# EasyEDA schematic schemes.json

## Sheets
1 Sheet_1: TITLE: Sheet_1; REV: 1.0; Date: 2024-04-25; Sheet: 1/1; Company: Your Company
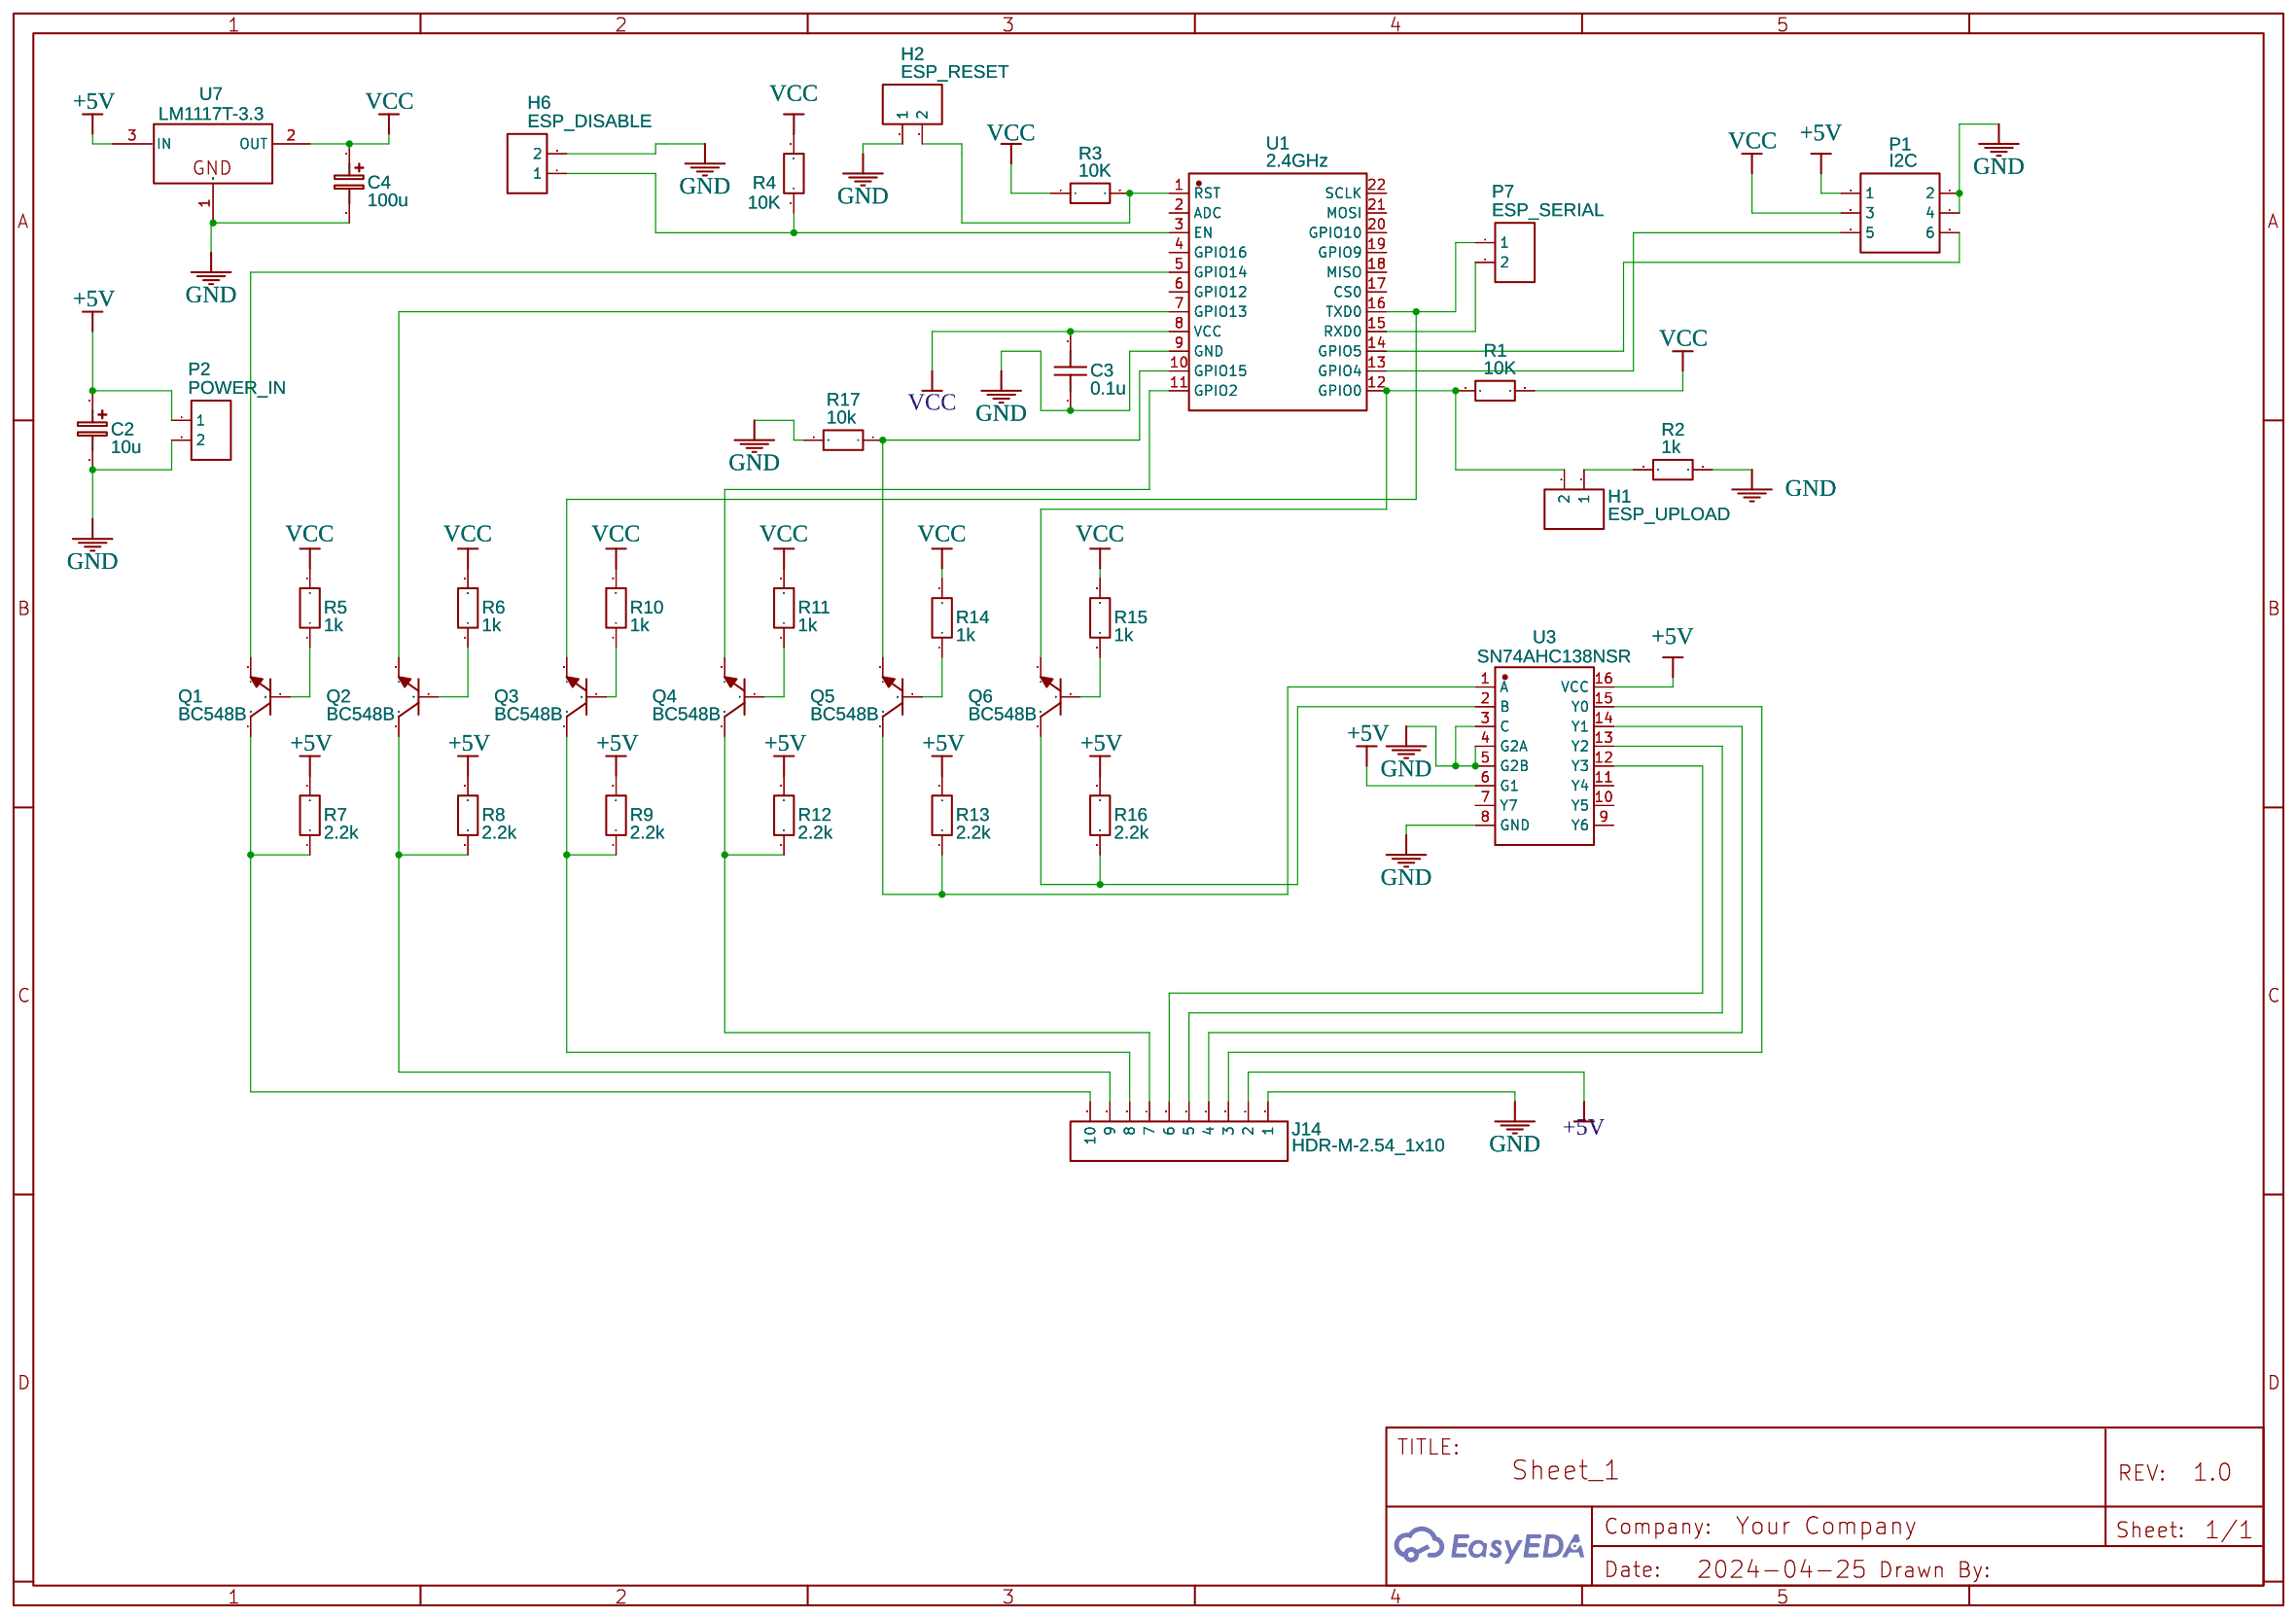
[diagram p0: Sheet_1]
2 Sheet_2: TITLE: Sheet_2; Date: 2024-07-30; Drawn By: juliaotran
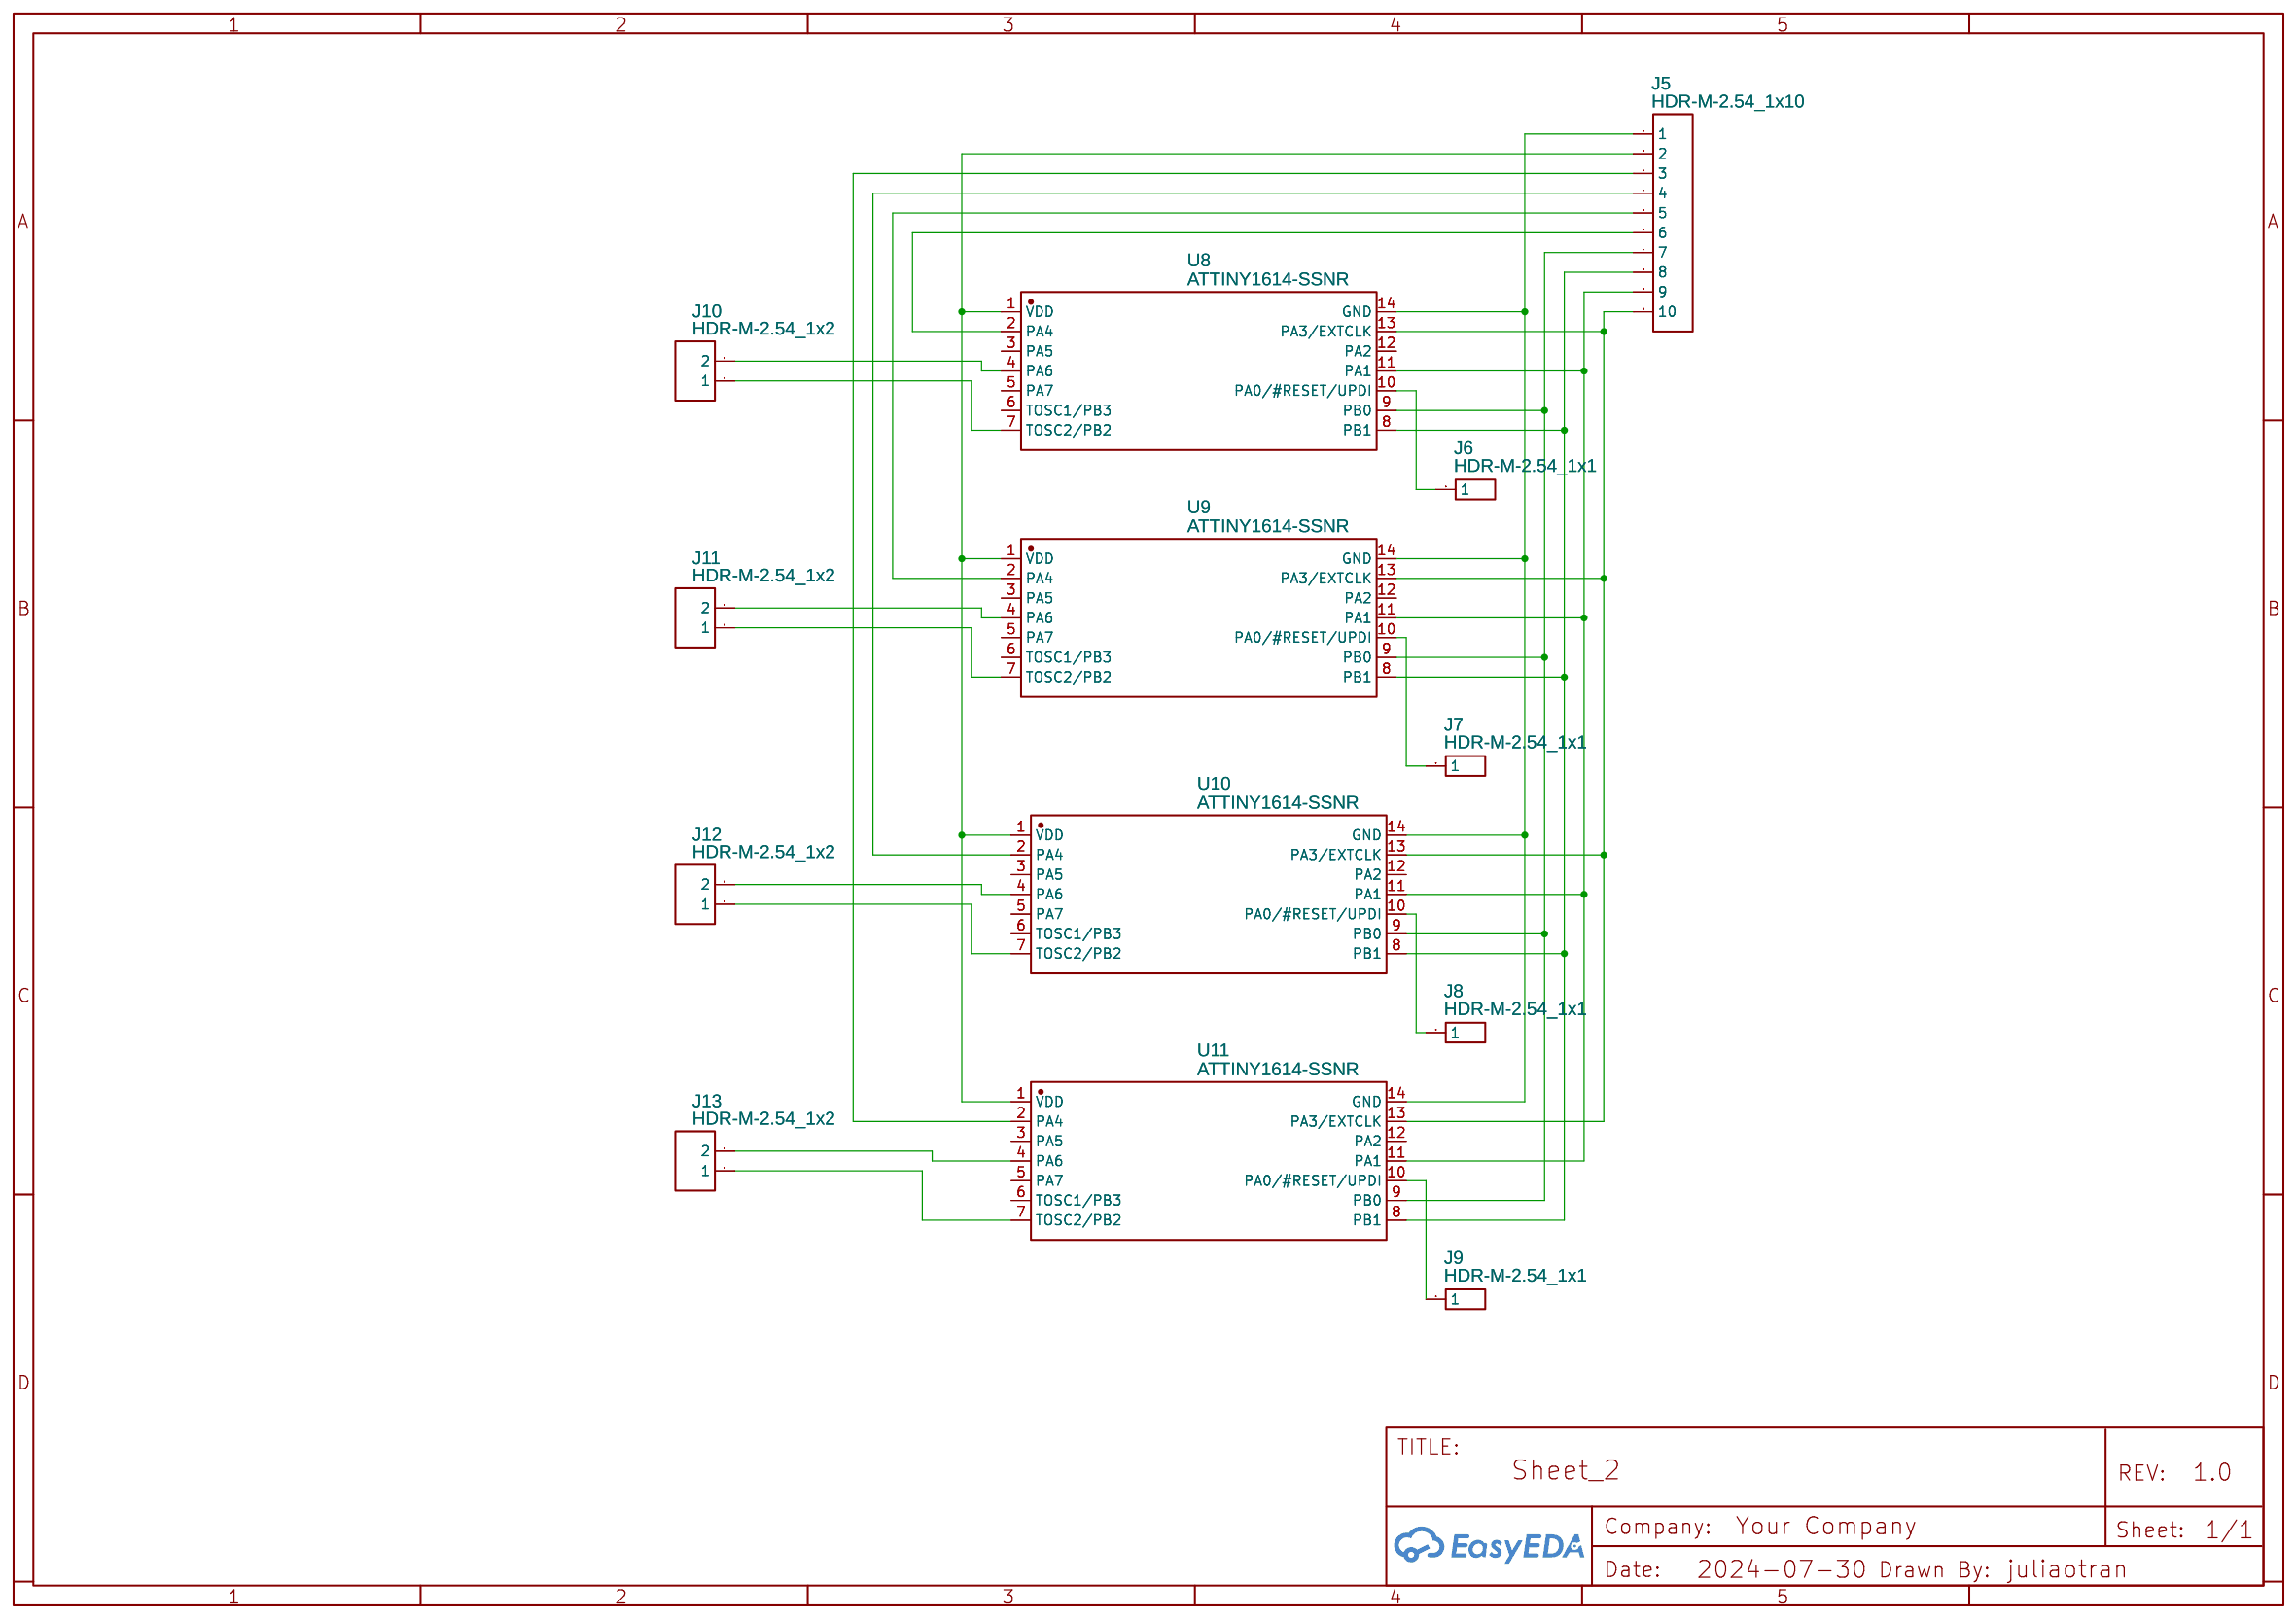
[diagram p1: Sheet_2]
3 Sheet_3: TITLE: Sheet_3; Date: 2024-09-19; Drawn By: juliaotran
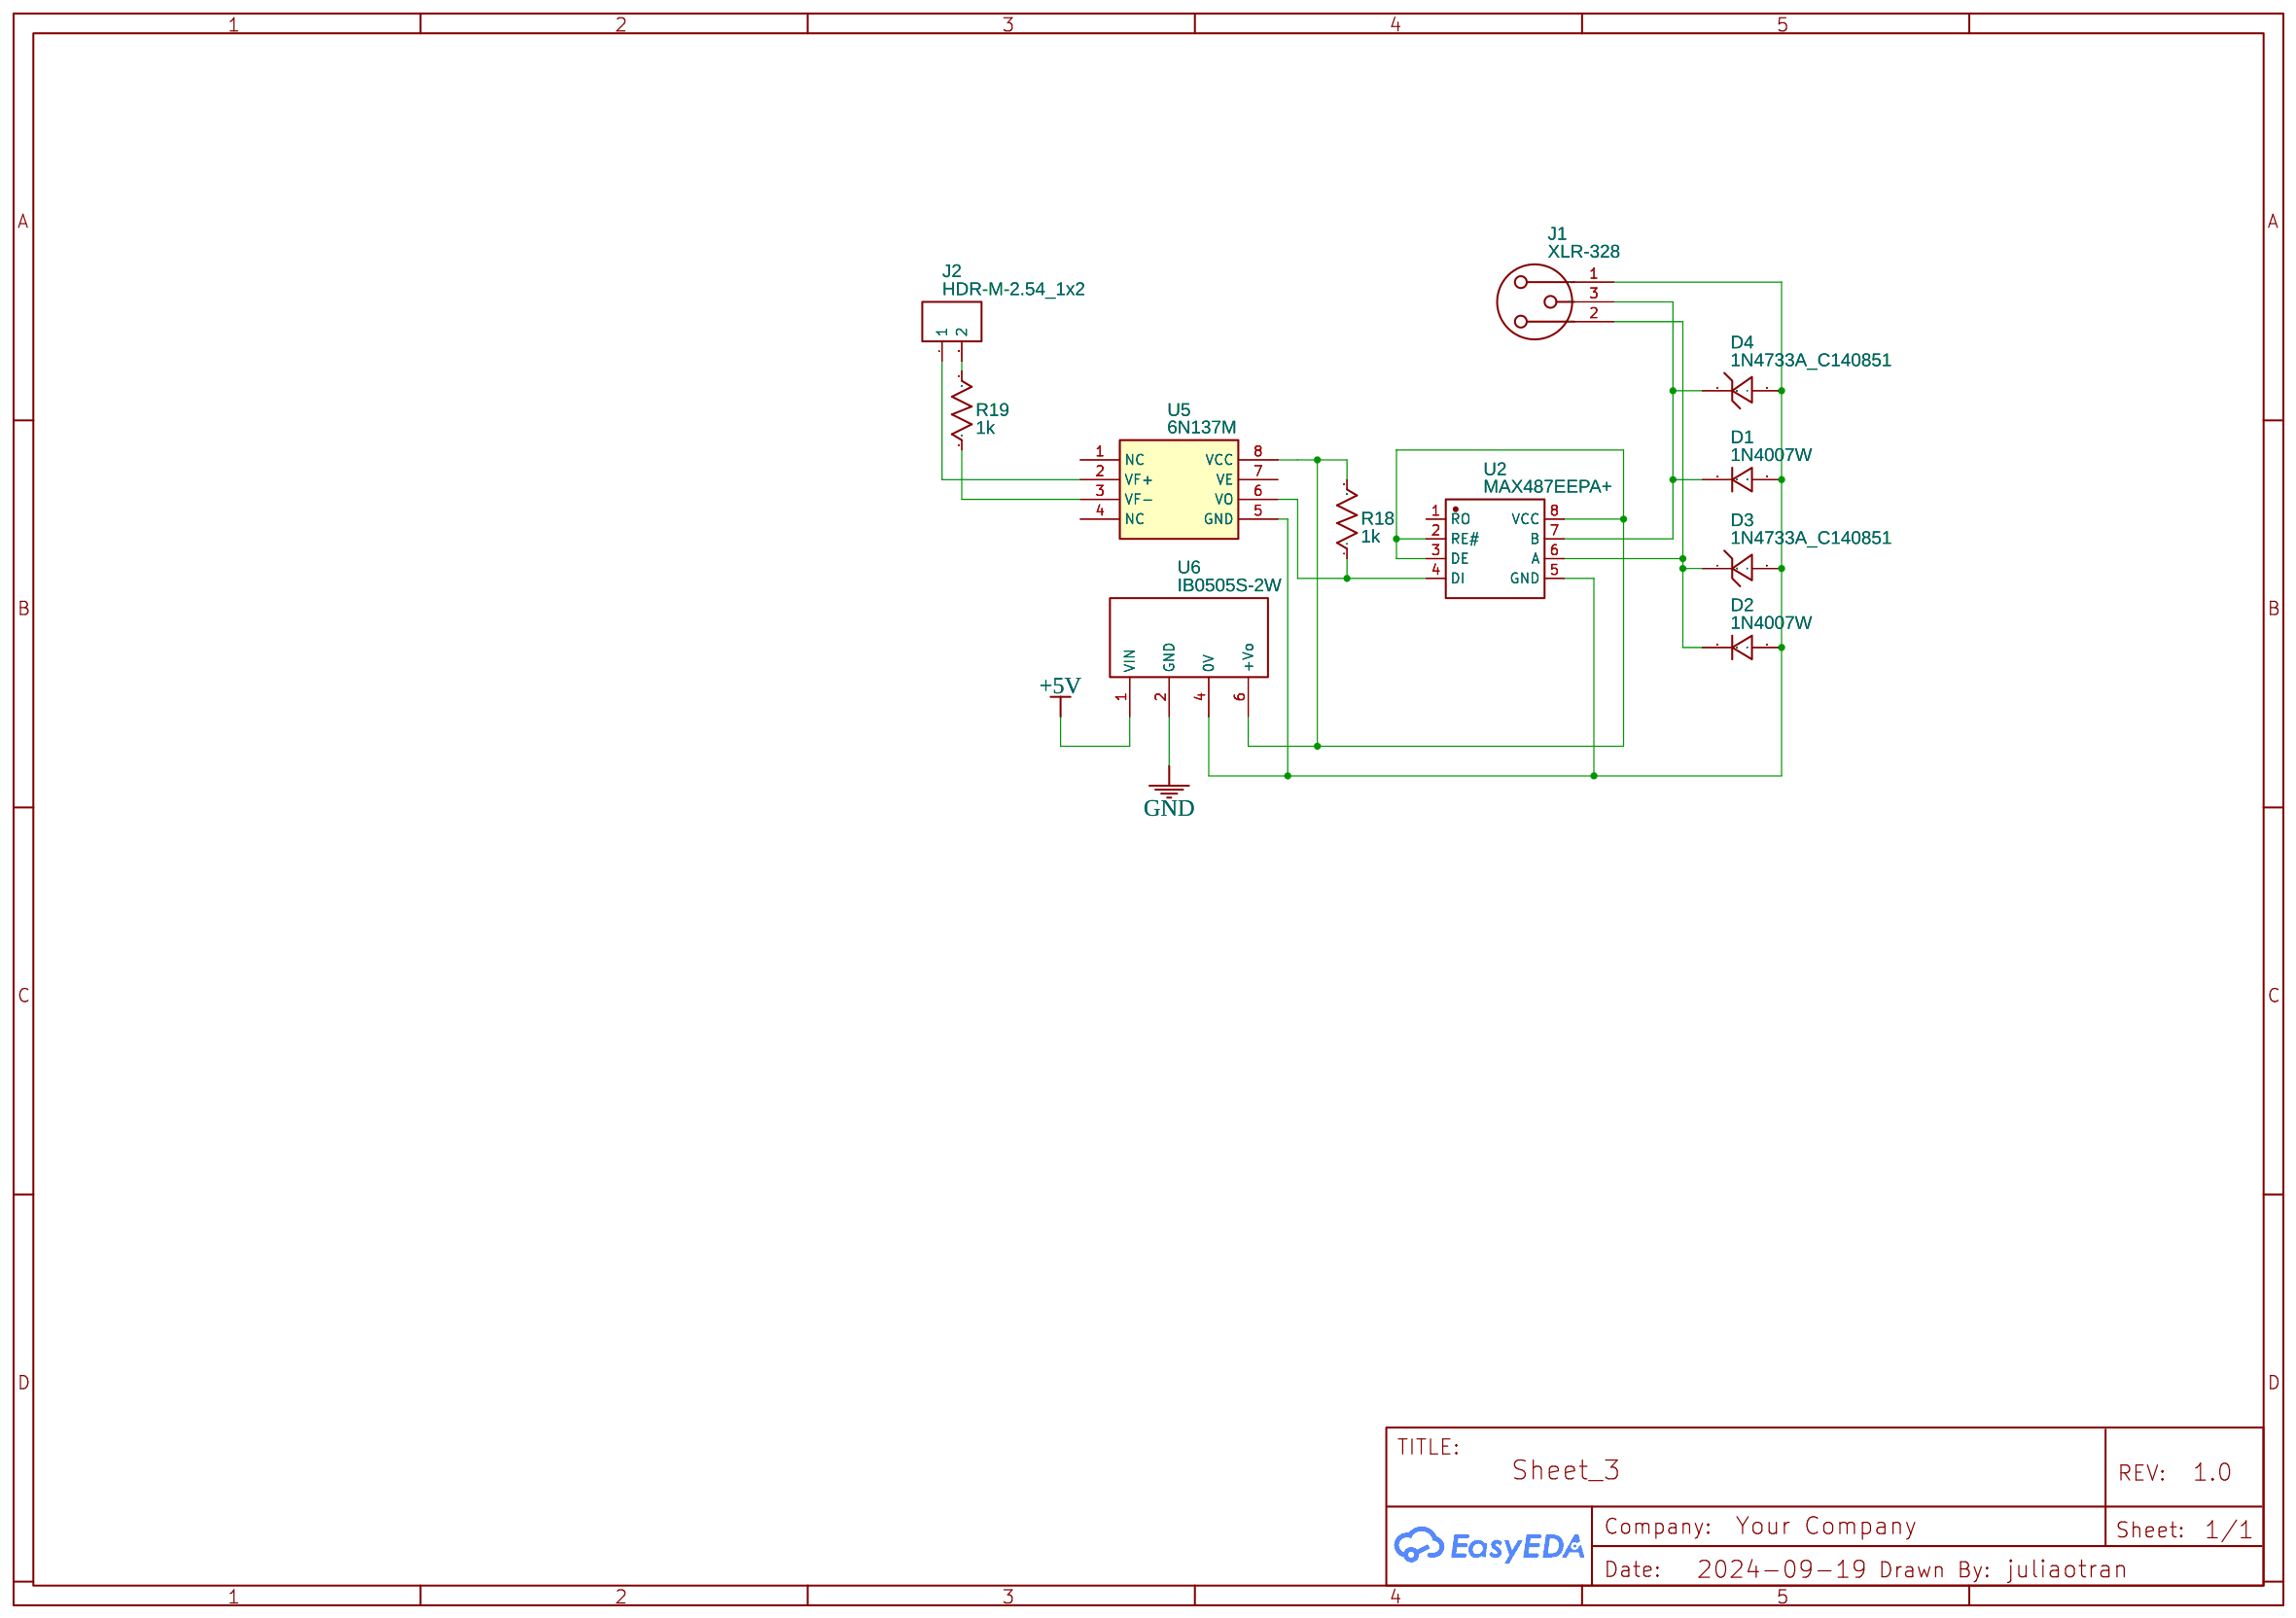
[diagram p2: Sheet_3]

## Parts
sheet Sheet_1
C2  10u  [CAP-D5.0-F2.0]
C3  0.1u  [CAP-TH_L5.0-W2.5-P2.50-D0.5]
C4  100u  [CAP-D5.0×F2.0]
H1  ESP_UPLOAD  [HDR-F-2.54_1X2]
H2  ESP_RESET  [HDR-F-2.54_1X2]
H6  ESP_DISABLE  [HDR-F-2.54_1X2]
J14  HDR-M-2.54_1x10  [HDR-M-2.54_1X10]
P1  I2C  [IDC-TH_6P-P2.54_C11214]
P2  POWER_IN  [CONN-TH_2P-P5.00]
P7  ESP_SERIAL  [HDR-F-2.54_1X2]
Q1  BC548B  [TO-92-3_L4.8-W3.7-P2.54-L]
Q2  BC548B  [TO-92-3_L4.8-W3.7-P2.54-L]
Q3  BC548B  [TO-92-3_L4.8-W3.7-P2.54-L]
Q4  BC548B  [TO-92-3_L4.8-W3.7-P2.54-L]
Q5  BC548B  [TO-92-3_L4.8-W3.7-P2.54-L]
Q6  BC548B  [TO-92-3_L4.8-W3.7-P2.54-L]
R1  10K  [R_AXIAL-0.4]
R2  1k  [R_AXIAL-0.4]
R3  10K  [R_AXIAL-0.4]
R4  10K  [R_AXIAL-0.4]
R5  1k  [R_AXIAL-0.4]
R6  1k  [R_AXIAL-0.4]
R7  2.2k  [R_AXIAL-0.4]
R8  2.2k  [R_AXIAL-0.4]
R9  2.2k  [R_AXIAL-0.4]
R10  1k  [R_AXIAL-0.4]
R11  1k  [R_AXIAL-0.4]
R12  2.2k  [R_AXIAL-0.4]
R13  2.2k  [R_AXIAL-0.4]
R14  1k  [R_AXIAL-0.4]
R15  1k  [R_AXIAL-0.4]
R16  2.2k  [R_AXIAL-0.4]
R17  10k  [R_AXIAL-0.4]
U1  2.4GHz  [WIFIM-SMD_ESP-12F-ESP8266MOD]
U3  SN74AHC138NSR  [SO-16_L9.9-W3.9-P1.27-LS6.0-BL]
U7  LM1117T-3.3  [TO-220-3_L10.0-W4.5-P2.54-L]
sheet Sheet_2
J5  HDR-M-2.54_1x10  [HDR-M-2.54_1X10]
J6  HDR-M-2.54_1x1  [HDR-M-2.54_1X1]
J7  HDR-M-2.54_1x1  [HDR-M-2.54_1X1]
J8  HDR-M-2.54_1x1  [HDR-M-2.54_1X1]
J9  HDR-M-2.54_1x1  [HDR-M-2.54_1X1]
J10  HDR-M-2.54_1x2  [HDR-M-2.54_1X2]
J11  HDR-M-2.54_1x2  [HDR-M-2.54_1X2]
J12  HDR-M-2.54_1x2  [HDR-M-2.54_1X2]
J13  HDR-M-2.54_1x2  [HDR-M-2.54_1X2]
U8  ATTINY1614-SSNR  [SOIC-14_L8.7-W3.9-P1.27-LS6.0-BL]
U9  ATTINY1614-SSNR  [SOIC-14_L8.7-W3.9-P1.27-LS6.0-BL]
U10  ATTINY1614-SSNR  [SOIC-14_L8.7-W3.9-P1.27-LS6.0-BL]
U11  ATTINY1614-SSNR  [SOIC-14_L8.7-W3.9-P1.27-LS6.0-BL]
sheet Sheet_3
D1  1N4007W  [SOD-123_L2.8-W1.8-LS3.7-RD]
D2  1N4007W  [SOD-123_L2.8-W1.8-LS3.7-RD]
D3  1N4733A_C140851  [DO-41_BD2.4-L4.7-P8.70-D0.9-RD]
D4  1N4733A_C140851  [DO-41_BD2.4-L4.7-P8.70-D0.9-RD]
J1  XLR-328  [CONN-TH_XLR-328]
J2  HDR-M-2.54_1x2  [HDR-M-2.54_1X2]
R18  1k  [R0603]
R19  1k  [R0603]
U2  MAX487EEPA+  [PDIP-8_L9.3-W6.4-P2.54-LS7.6-BL]
U5  6N137M  [DIP-8_L9.7-W6.6-LS7.62-P2.54-BL]
U6  IB0505S-2W  [PWRM-TH_IBXXXXS-2W]

## Library data of the parts
C2 = CE_SMD_D4.0×H5.5_EU: Contributor: LCEDA_Lib
C3 = C_1206_US: Contributor: LCEDA_Lib
C4 = CE_TH_D5.0×F2.0_EU: Contributor: LCEDA_Lib
H1 H2 H6 = HDR-F-2.54_1x2: Supplier Part: C49661; Supplier: LCSC; Contributor: LCEDA_Lib
J5 J14 = HDR-M-2.54_1x10: Supplier Part: C57369; Supplier: LCSC; Contributor: LCEDA_Lib
P1 = HDR-IDC-2.54-2X3P: Supplier: LCSC; Manufacturer: BOOMELE; Manufacturer Part: 2X3 2.54mm IDC Box; image: //image.lceda.cn/szlcsc/C11214.jpg; Supplier Part: C11214
P2 P7 = CONN-TH_2P-P5.00: Supplier: LCSC; Contributor: LCEDA_Lib
Q1-Q6 = BC548B: Supplier: LCSC; Manufacturer: CJ(江苏长电/长晶); Manufacturer Part: BC548; Supplier Part: C36611; JLCPCB Part Class: Extended Part
R1-R17 = R_0603_EU: Contributor: LCEDA_Lib
U1 = ESP-12F(ESP8266MOD): Supplier: LCSC; Manufacturer: Ai-Thinker(安信可); Supplier Part: C82891; JLCPCB Part Class: Extended Part
U3 = SN74AHC138NSR: Contributor: LCSC; Supplier: LCSC; Supplier Part: C2674689; Manufacturer: TI(德州仪器); JLCPCB Part Class: Extended Part
U7 = LM1117T-3.3: Contributor: LCSC; Supplier: LCSC; Supplier Part: C498321; Manufacturer: HGSEMI(华冠); JLCPCB Part Class: Extended Part
J6-J9 = HDR-M-2.54_1x1: Supplier Part: C81276; Supplier: LCSC; Contributor: LCEDA_Lib
J2 J10-J13 = HDR-M-2.54_1x2: Supplier Part: C124375; Supplier: LCSC; Contributor: LCEDA_Lib
U8-U11 = ATTINY1614-SSNR: Contributor: LCSC; Supplier: LCSC; Supplier Part: C481364; Manufacturer: MICROCHIP(美国微芯); JLCPCB Part Class: Extended Part
D1 D2 = 1N4007W: Supplier: LCSC; Supplier Part: C328592; Manufacturer: BLUE ROCKET; Contributor: LCEDA_Lib
D3 D4 = 1N4733A_C140851: Contributor: LCSC; Supplier: LCSC; Supplier Part: C140851; Manufacturer: onsemi(安森美); Manufacturer Part: 1N4733A; JLCPCB Part Class: Extended Part
J1 = XLR-328: Contributor: LCSC; Supplier: LCSC; Supplier Part: C309327; Manufacturer: HOOYA(皓宇电子); JLCPCB Part Class: Extended Part
R18 R19 = R_0603_US: Contributor: LCEDA_Lib
U2 = MAX487EEPA+: Contributor: LCSC; Supplier: LCSC; Supplier Part: C2682623; Manufacturer: ADI(亚德诺)/MAXIM(美信); JLCPCB Part Class: Extended Part
U5 = 6N137M: Supplier: LCSC; Manufacturer: onsemi(安森美); Supplier Part: C5344; JLCPCB Part Class: Extended Part
U6 = IB0505S-2W: Supplier: LCSC; Manufacturer: MORNSUN(金升阳); Supplier Part: C9758; JLCPCB Part Class: Extended Part

## Nets
+5V: C2.1 J14.2 P1.1 P2.1 R7.2 R8.2 R9.2 R12.2 R13.2 R16.2 U3.6(G1) U3.16(VCC) U6.1(VIN) U7.3(IN)
GND: C2.2 C3.1 C4.2 H2.1 H6.2 J14.1 P1.2 P1.4 P2.2 R2.2 R17.2 U1.9(GND) U3.3(C) U3.4(G2A) U3.5(G2B) U3.8(GND) U6.2(GND) U7.1(GND)
VCC: C3.2 C4.1 P1.3 R1.2 R3.1 R4.2 R5.2 R6.2 R10.2 R11.2 R14.2 R15.2 U1.8(VCC) U7.2(OUT)
Net-(D1-1): D1.1 D4.1(C) J1.3 U2.7(B)
Net-(D1-2): D1.2 D2.2 D3.2(A) D4.2(A) J1.1 U2.5(GND) U5.5(GND) U6.4(0V)
Net-(D2-1): D2.1 D3.1(C) J1.2 U2.6(A)
Net-(H1-1): H1.1 R2.1
Net-(H1-2): H1.2 Q6.3(E) R1.1 U1.12(GPIO0)
Net-(H2-2): H2.2 R3.2 U1.1(RST)
Net-(H6-1): H6.1 R4.1 U1.3(EN)
Net-(J2-1): J2.1 U5.2(VF+)
Net-(J2-2): J2.2 R19.2
Net-(J5-1): J5.1 U8.14(GND) U9.14(GND) U10.14(GND) U11.14(GND)
Net-(J5-2): J5.2 U8.1(VDD) U9.1(VDD) U10.1(VDD) U11.1(VDD)
Net-(J5-3): J5.3 U11.2(PA4)
Net-(J5-4): J5.4 U10.2(PA4)
Net-(J5-5): J5.5 U9.2(PA4)
Net-(J5-6): J5.6 U8.2(PA4)
Net-(J5-7): J5.7 U8.9(PB0) U9.9(PB0) U10.9(PB0) U11.9(PB0)
Net-(J5-8): J5.8 U8.8(PB1) U9.8(PB1) U10.8(PB1) U11.8(PB1)
Net-(J5-9): J5.9 U8.11(PA1) U9.11(PA1) U10.11(PA1) U11.11(PA1)
Net-(J5-10): J5.10 U8.13(PA3/EXTCLK) U9.13(PA3/EXTCLK) U10.13(PA3/EXTCLK) U11.13(PA3/EXTCLK)
Net-(J6-1): J6.1 U8.10(PA0/#RESET/UPDI)
Net-(J7-1): J7.1 U9.10(PA0/#RESET/UPDI)
Net-(J8-1): J8.1 U10.10(PA0/#RESET/UPDI)
Net-(J9-1): J9.1 U11.10(PA0/#RESET/UPDI)
Net-(J10-1): J10.1 U8.7(TOSC2/PB2)
Net-(J10-2): J10.2 U8.4(PA6)
Net-(J11-1): J11.1 U9.7(TOSC2/PB2)
Net-(J11-2): J11.2 U9.4(PA6)
Net-(J12-1): J12.1 U10.7(TOSC2/PB2)
Net-(J12-2): J12.2 U10.4(PA6)
Net-(J13-1): J13.1 U11.7(TOSC2/PB2)
Net-(J13-2): J13.2 U11.4(PA6)
Net-(J14-3): J14.3 U3.15(Y0)
Net-(J14-4): J14.4 U3.14(Y1)
Net-(J14-5): J14.5 U3.13(Y2)
Net-(J14-6): J14.6 U3.12(Y3)
Net-(J14-7): J14.7 Q4.1(C) R12.1
Net-(J14-8): J14.8 Q3.1(C) R9.1
Net-(J14-9): J14.9 Q2.1(C) R8.1
Net-(J14-10): J14.10 Q1.1(C) R7.1
Net-(P1-5): P1.5 U1.13(GPIO4)
Net-(P1-6): P1.6 U1.14(GPIO5)
Net-(P7-1): P7.1 Q3.3(E) U1.16(TXD0)
Net-(P7-2): P7.2 U1.15(RXD0)
Net-(Q1-2): Q1.2(B) R5.1
Net-(Q1-3): Q1.3(E) U1.5(GPIO14)
Net-(Q2-2): Q2.2(B) R6.1
Net-(Q2-3): Q2.3(E) U1.7(GPIO13)
Net-(Q3-2): Q3.2(B) R10.1
Net-(Q4-2): Q4.2(B) R11.1
Net-(Q4-3): Q4.3(E) U1.11(GPIO2)
Net-(Q5-1): Q5.1(C) R13.1 U3.1(A)
Net-(Q5-2): Q5.2(B) R14.1
Net-(Q5-3): Q5.3(E) R17.1 U1.10(GPIO15)
Net-(Q6-1): Q6.1(C) R16.1 U3.2(B)
Net-(Q6-2): Q6.2(B) R15.1
Net-(R18-1): R18.1 U2.4(DI) U5.6(VO)
Net-(R18-2): R18.2 U2.2(RE#) U2.3(DE) U2.8(VCC) U5.8(VCC) U6.6(+Vo)
Net-(R19-1): R19.1 U5.3(VF-)

Not connected (* = marked no-connect by the designer): U1 2(ADC) 4(GPIO16) 6(GPIO12) 17(CS0) 18(MISO) 19(GPIO9) 20(GPIO10) 21(MOSI) 22(SCLK); U2 1(RO); U3 7(Y7) 9(Y6) 10(Y5) 11(Y4); U5 1(NC) 4(NC) 7(VE); U8 3(PA5) 5(PA7) 6(TOSC1/PB3) 12(PA2); U9 3(PA5) 5(PA7) 6(TOSC1/PB3) 12(PA2); U10 3(PA5) 5(PA7) 6(TOSC1/PB3) 12(PA2); U11 3(PA5) 5(PA7) 6(TOSC1/PB3) 12(PA2)
